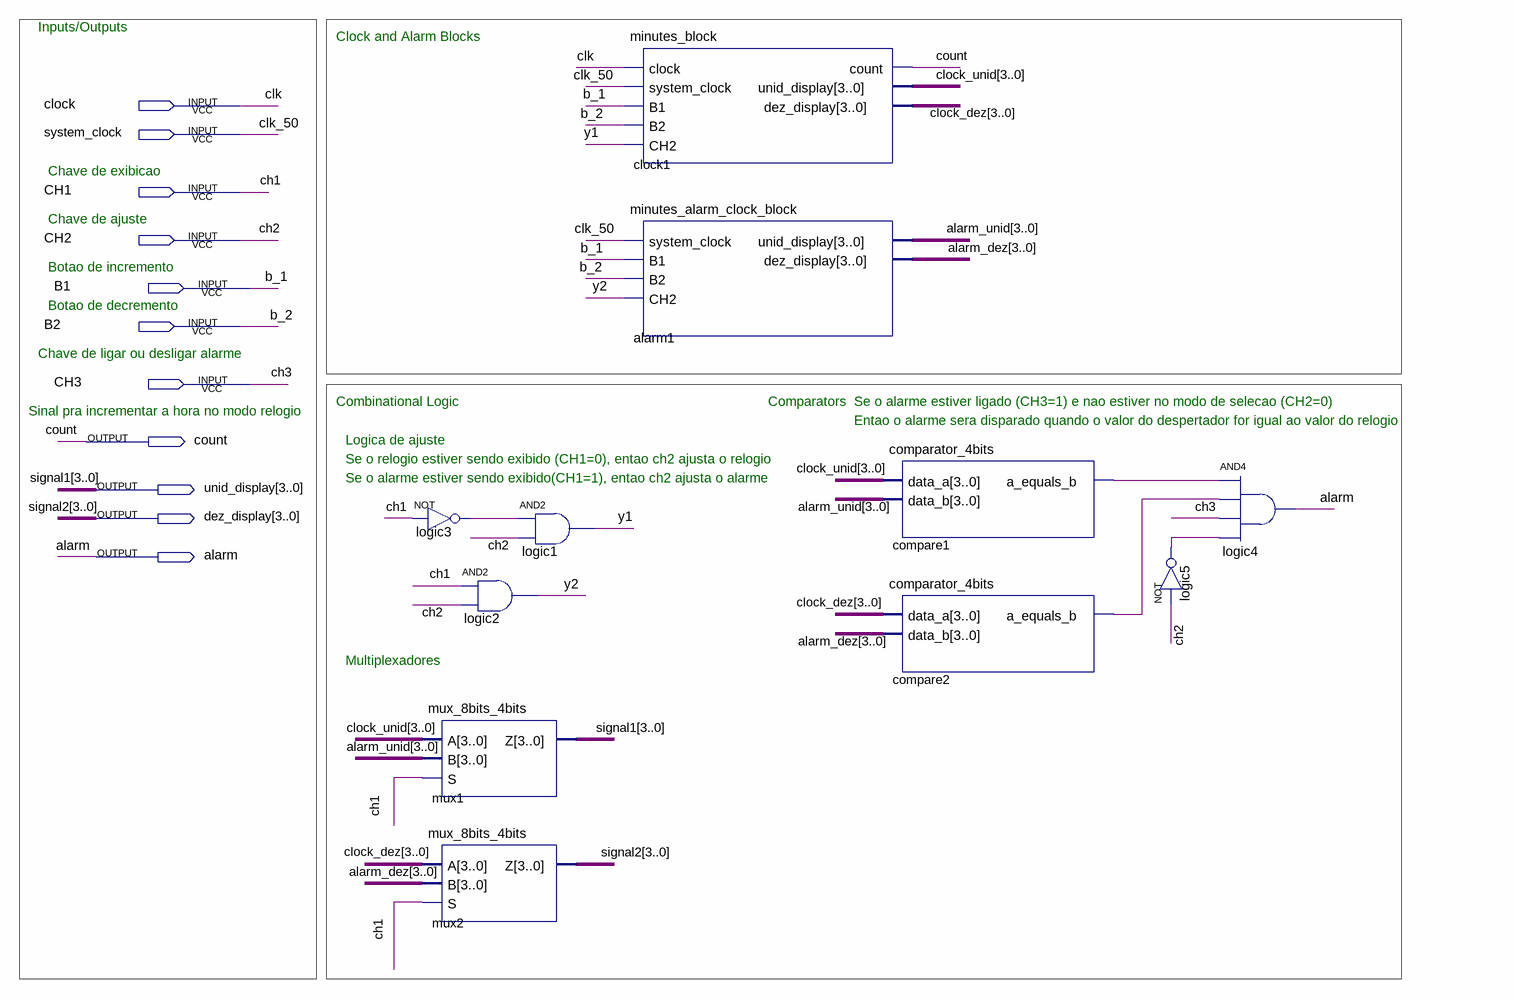
[diagram p0: schematic sheet]
// Quartus schematic all_minutes_block.bdf as structural Verilog: 11 symbols, 11 pins
module all_minutes_block (
  input  clock,
  input  system_clock,
  input  CH1,
  input  CH2,
  input  B1,
  input  B2,
  input  CH3,
  output count,
  output [3:0] unid_display,
  output [3:0] dez_display,
  output alarm
);

  wire compare1_a_equals_b, compare2_a_equals_b, logic3_out, logic5_out, y1, y2;
  wire [3:0] alarm_dez, alarm_unid, clock_dez, clock_unid;

  not logic3 (logic3_out, CH1);
  mux_8bits_4bits mux1 (.A(clock_unid), .B(alarm_unid), .S(CH1), .Z(unid_display));
  mux_8bits_4bits mux2 (.A(clock_dez), .B(alarm_dez), .S(CH1), .Z(dez_display));
  and logic1 (y1, logic3_out, CH2);
  and logic2 (y2, CH1, CH2);
  minutes_block clock1 (
    .clock(clock), .system_clock(system_clock), .B1(B1), .B2(B2), .CH2(y1), .count(count),
    .unid_display(clock_unid), .dez_display(clock_dez));
  minutes_alarm_clock_block alarm1 (
    .system_clock(system_clock), .B1(B1), .B2(B2), .CH2(y2), .unid_display(alarm_unid),
    .dez_display(alarm_dez));
  comparator_4bits compare1 (.data_a(clock_unid), .data_b(alarm_unid), .a_equals_b(compare1_a_equals_b));
  comparator_4bits compare2 (.data_a(clock_dez), .data_b(alarm_dez), .a_equals_b(compare2_a_equals_b));
  not logic5 (logic5_out, CH2);
  and logic4 (alarm, compare1_a_equals_b, compare2_a_equals_b, CH3, logic5_out);

  // Other names for the same wires on the sheet: b_1 = B1; b_2 = B2; clk = clock; clk_50 = system_clock;
  //   signal1[3:0] = unid_display; signal2[3:0] = dez_display

  // Notes on the sheet:
  //   Inputs/Outputs
  //   Clock and Alarm Blocks
  //   Chave de exibicao
  //   Chave de ajuste
  //   Botao de incremento
  //   Botao de decremento
  //   Chave de ligar ou desligar alarme
  //   Combinational Logic
  //   Comparators
  //   Se o alarme estiver ligado (CH3=1) e nao estiver no modo de selecao (CH2=0)
  //   Sinal pra incrementar a hora no modo relogio
  //   Entao o alarme sera disparado quando o valor do despertador for igual ao valor do relogio
  //   Logica de ajuste
  //   Se o relogio estiver sendo exibido (CH1=0), entao ch2 ajusta o relogio
  //   Se o alarme estiver sendo exibido(CH1=1), entao ch2 ajusta o alarme
  //   Multiplexadores
endmodule
